# EAGLE board SARA-R5 (EAGLE 9.5.1)
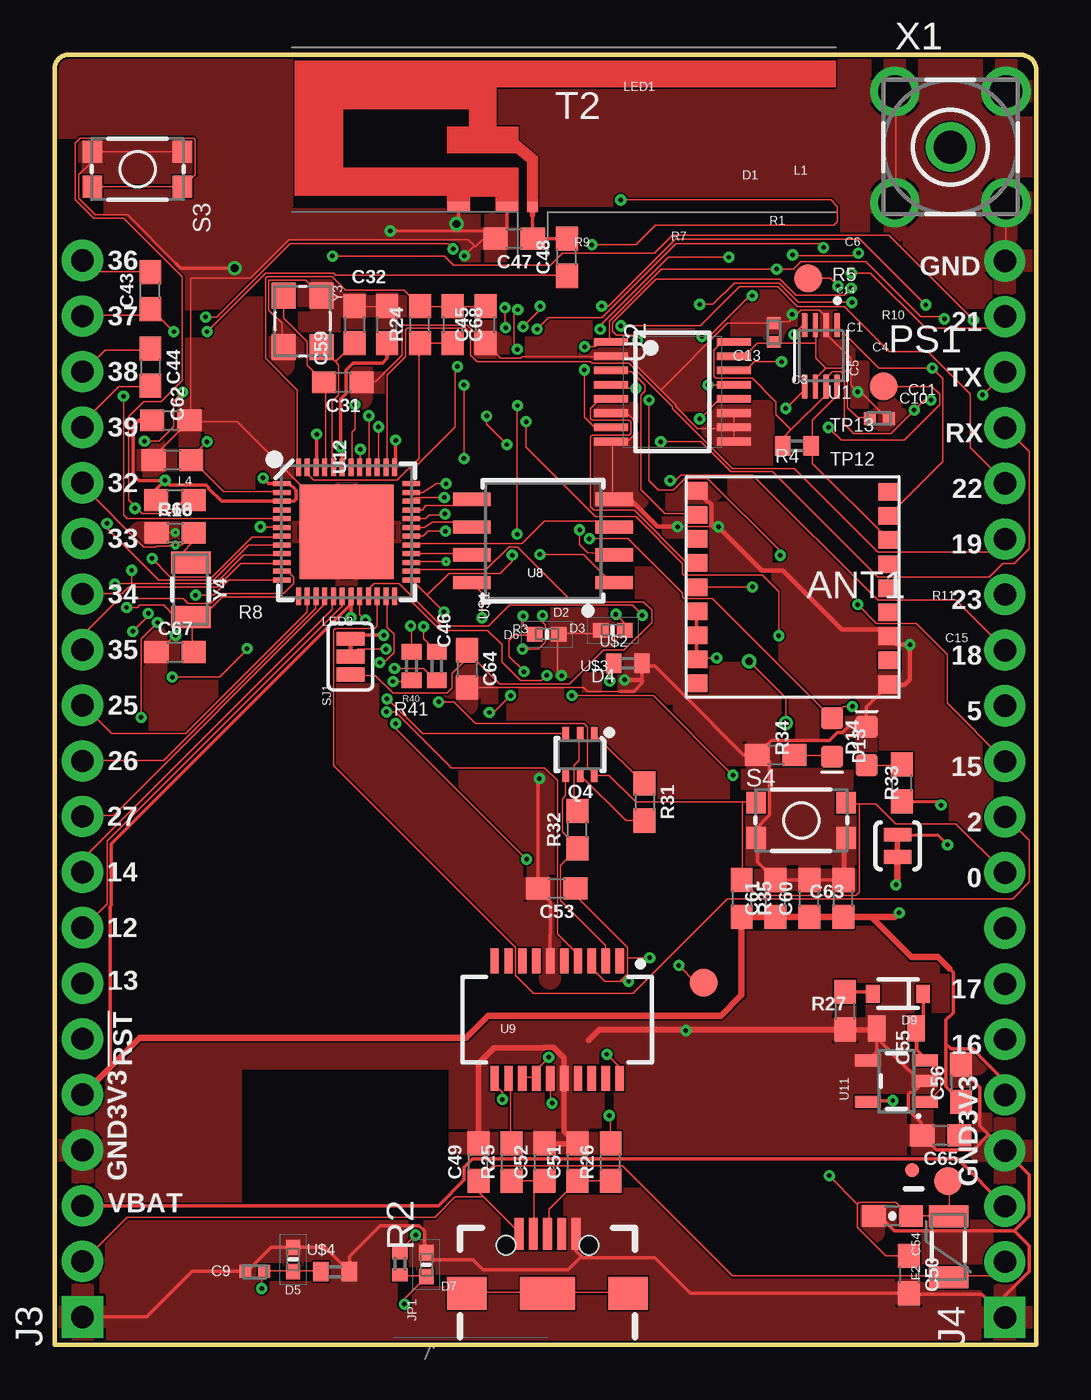
[diagram p3: board, top side]
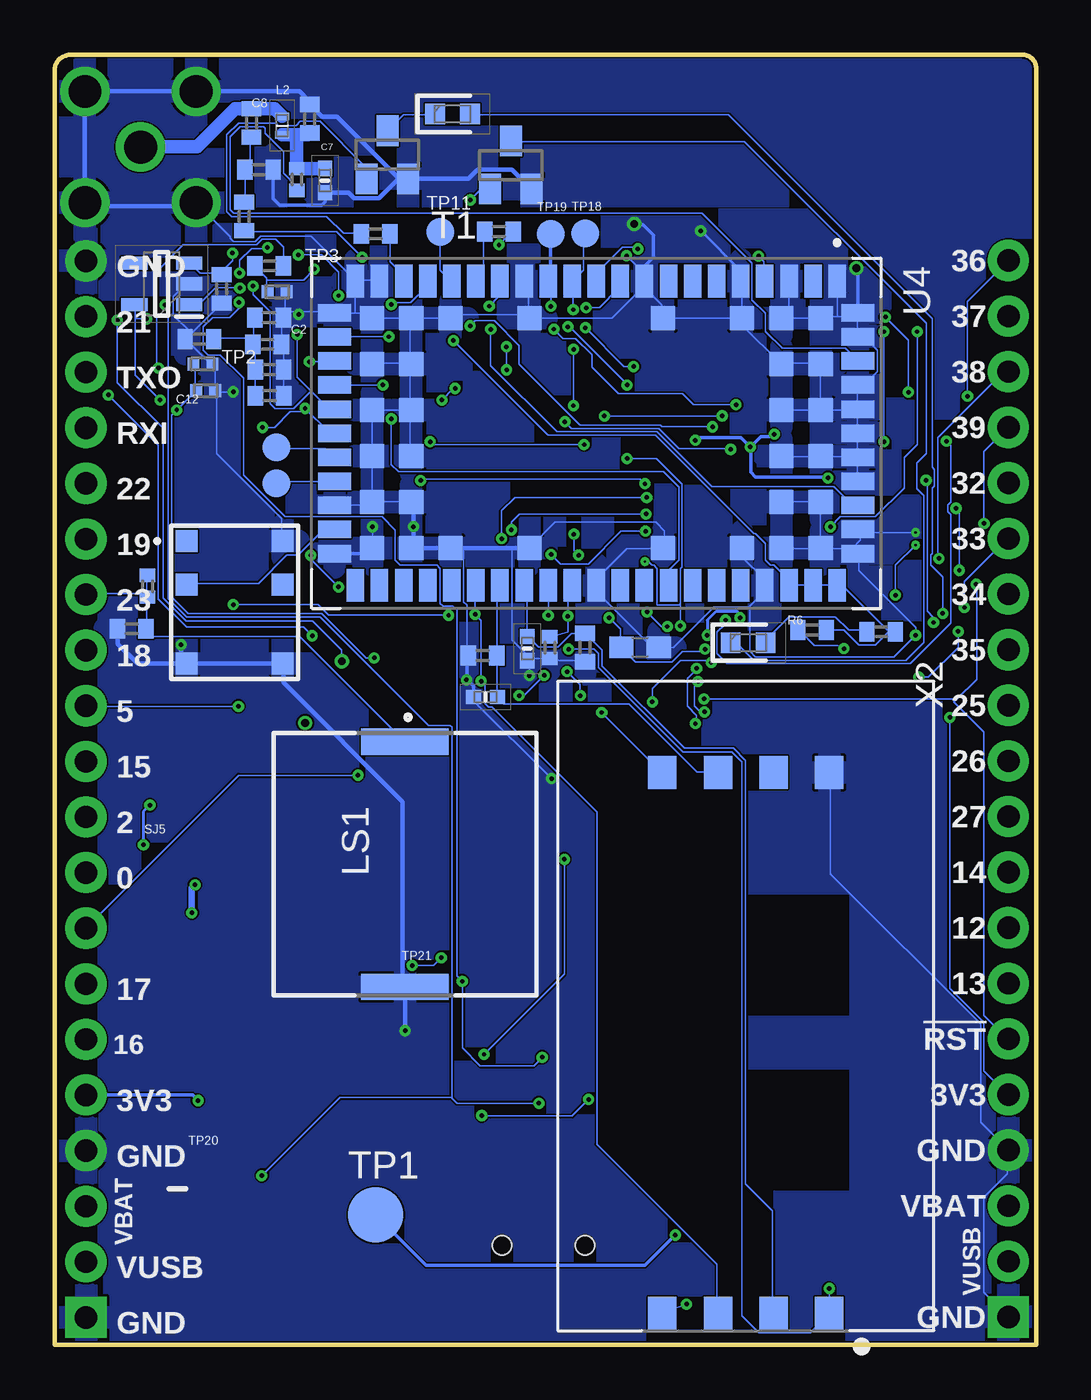
[diagram p4: board, bottom side, seen from below]

Size 44.84 x 58.93 mm. Coordinates in mm from the lower left corner, seen from the top.
Outline: 0,0 0,58.29 arc-90 0.64,58.93 44.02,58.92 arc-90 44.84,58.3 44.84,0.01 0,0
Copper layers (1*16): Top 0.035mm / dielectric 1.5mm / Bottom 0.035mm
Design rules "default *": minimum track width 3mil, minimum drill 2mil, track to track 3mil, track to pad 3mil, pad to pad 3mil, via to via 3mil, smd to smd 3mil, copper to edge 3mil, drill to drill 2mil, minimum pad ring 6mil, minimum via ring 6mil, stop-mask expansion 4mil, vias tented up to drill 25mil, thermal gap 5mil

## Footprints (pad centres in the part's own frame; a part is rotated, then mirrored left to right if it is on the bottom)
SR4G008 = smd 1 x 1: 1 -2.8,-2.2; 2 -0.8,-2.2; 3 2.8,-2.2; 4 2.8,2.2; 5 -0.8,2.2; 6 -2.8,2.2
C0402 = smd 0.7 x 0.9: 1 -0.65,0; 2 0.65,0
CAPC1005X55N = smd 0.54 x 0.6: 1 -0.432,0; 2 0.432,0
0603 = smd 1.1 x 1: 1 -0.85,0; 2 0.85,0
0603-CAP = smd 1.1 x 1: 1 -0.85,0; 2 0.85,0
0805 = smd 0.8 x 1.2: 1 -0.9,0; 2 0.9,0
DIONC1005X43N = smd 0.7 x 0.65: 1 -0.55,0; 2 0.55,0
SOD-323 = smd 0.63 x 0.83: A 1.15,0; C -1.15,0
LED-0603 = smd 1 x 1: A 0,-0.877; C 0,0.877
TRACE_ANTENNA_2.4GHZ_25.7MM_TUNED = smd 0.46 x 0.46: ANT 0,0.23 | smd 1 x 0.46: GND -1.18,0.23; GND2 -3.38,0.23
PTC-1206 = smd 1 x 1.8: 1 -1.4,0; 2 1.4,0
MICRO-FIDUCIAL = smd 0.635 x 0.635: 1 0,0
1X20_NOSILK = drill 1.016 pad 1.88 square: 1 0,0 | drill 1.016 pad 1.88: 2 2.54,0; 3 5.08,0; 4 7.62,0; 5 10.16,0; 6 12.7,0; 7 15.24,0; 8 17.78,0; 9 20.32,0; 10 22.86,0; 11 25.4,0; 12 27.94,0; 13 30.48,0; 14 33.02,0; 15 35.56,0; 16 38.1,0; 17 40.64,0; 18 43.18,0; 19 45.72,0; 20 48.26,0
USB-B-MICRO-SMD_V03 = smd 1.45 x 0.4: D+ 2.725,0; D- 2.725,0.65; GND 2.725,-1.3; ID 2.725,-0.65; VBUS 2.725,1.3 | smd 1.5 x 1.8: SHIELD1 0,3.685; SHIELD2 0,-3.685 | smd 1.5 x 2.5: SHIELD3 0,0 | hole 0.85: 2.2,1.9; 2.2,-1.9
L0402 = smd 0.7 x 0.9: 1 -0.65,0; 2 0.65,0
LQG15WH0N7B02D = smd 0.35 x 0.65: 1 -0.425,0; 2 0.425,0
LEDC1608X80N = smd 0.9 x 0.95: 1 -0.8,0; 2 0.8,0
PKLCS1212E2000-R1 = smd 1.2 x 4: 1 -5.6,0; 2 5.6,0
SOT95P280X145-5N = smd 1.2 x 0.6: 1 -1.25,0.95; 2 -1.25,0; 3 -1.25,-0.95; 4 1.25,-0.95; 5 1.25,0.95
SC70-6 = smd 0.3 x 0.66: 1 -0.65,-0.92; 2 0,-0.92; 3 0.65,-0.92; 4 0.65,0.92; 5 0,0.92; 6 -0.65,0.92
R0402 = smd 0.6 x 0.7: 1 -0.5,0; 2 0.5,0
R0402' = smd 0.7 x 0.9: 1 -0.65,0; 2 0.65,0
TACTILE_SWITCH_SMD_4.6X2.8MM = smd 0.9 x 1: 1 -2.05,-0.8; 2 2.05,-0.8; 3 2.05,0.8; 4 -2.05,0.8
PAD-JUMPER-3-2OF3_NC_BY_TRACE_YES_SILK_FULL_BOX = smd 0.635 x 1.27: 1 -0.813,0; 2 0,0; 3 0.813,0
PAD-JUMPER-2-NC_BY_TRACE_YES_SILK = smd 0.635 x 1.27: 1 -0.508,0; 2 0.508,0
SOT23 = smd 1 x 1.4: 1 -0.95,-1.1; 2 0.95,-1.1; 3 0,1.1
B2,54 = smd 2.54 x 2.54: TP 0,0
B1,27 = smd 1.27 x 1.27: TP 0,0
SOP50P310X90-8N = smd 1.12 x 0.27: 1 -1.405,0.75; 2 -1.405,0.25; 3 -1.405,-0.25; 4 -1.405,-0.75; 5 1.405,-0.75; 6 1.405,-0.25; 7 1.405,0.25; 8 1.405,0.75
TSSOP16 = smd 0.35 x 1.55: 1 -2.275,-2.8; 2 -1.625,-2.8; 3 -0.975,-2.8; 4 -0.325,-2.8; 5 0.325,-2.8; 6 0.975,-2.8; 7 1.625,-2.8; 8 2.275,-2.8; 9 2.275,2.8; 10 1.625,2.8; 11 0.975,2.8; 12 0.325,2.8; 13 -0.325,2.8; 14 -0.975,2.8; 15 -1.625,2.8; 16 -2.275,2.8
SARA-R5 = smd 1.5 x 0.8: 1 -6.95,11; 2 -6.95,9.9; 3 -6.95,8.8; 4 -6.95,7.7; 5 -6.95,6.6; 6 -6.95,5.5; 7 -6.95,4.4; 8 -6.95,3.3; 9 -6.95,2.2; 10 -6.95,1.1; 11 -6.95,0; 12 -6.95,-1.1; 13 -6.95,-2.2; 14 -6.95,-3.3; 15 -6.95,-4.4; 16 -6.95,-5.5; 17 -6.95,-6.6; 18 -6.95,-7.7; 19 -6.95,-8.8; 20 -6.95,-9.9; 21 -6.95,-11; 33 6.95,-11; 34 6.95,-9.9; 35 6.95,-8.8; 36 6.95,-7.7; 37 6.95,-6.6; 38 6.95,-5.5; 39 6.95,-4.4; 40 6.95,-3.3; 41 6.95,-2.2; 42 6.95,-1.1; 43 6.95,0; 44 6.95,1.1; 45 6.95,2.2; 46 6.95,3.3; 47 6.95,4.4; 48 6.95,5.5; 49 6.95,6.6; 50 6.95,7.7; 51 6.95,8.8; 52 6.95,9.9; 53 6.95,11 | smd 0.8 x 1.5: 22 -5.5,-11.95; 23 -4.4,-11.95; 24 -3.3,-11.95; 25 -2.2,-11.95; 26 -1.1,-11.95; 27 0,-11.95; 28 1.1,-11.95; 29 2.2,-11.95; 30 3.3,-11.95; 31 4.4,-11.95; 32 5.5,-11.95; 54 5.5,11.95; 55 4.4,11.95; 56 3.3,11.95; 57 2.2,11.95; 58 1.1,11.95; 59 0,11.95; 60 -1.1,11.95; 61 -2.2,11.95; 62 -3.3,11.95; 63 -4.4,11.95; 64 -5.5,11.95 | smd 1.1 x 1.1: 65 -5.25,10.25; 66 -3.15,10.25; 67 -1.05,10.25; 68 1.05,10.25; 69 3.15,10.25; 70 5.25,10.25; 71 -5.25,8.45; 72 -3.15,8.45; 73 -1.05,8.45; 74 1.05,8.45; 75 3.15,8.45; 76 5.25,8.45; 77 -5.25,6.65; 78 5.25,6.65; 79 -5.25,3.05; 80 5.25,3.05; 81 -5.25,-3.05; 82 5.25,-3.05; 83 -5.25,-6.65; 84 5.25,-6.65; 85 -5.25,-8.45; 86 -3.15,-8.45; 87 -1.05,-8.45; 88 1.05,-8.45; 89 3.15,-8.45; 90 5.25,-8.45; 91 -5.25,-10.25; 92 -3.15,-10.25; 93 -1.05,-10.25; 94 1.05,-10.25; 95 3.15,-10.25; 96 5.25,-10.25
SOIC-8 = smd 0.61 x 1.702: 1 -1.905,-3.251; 2 -0.635,-3.251; 3 0.635,-3.251; 4 1.905,-3.251; 5 1.905,3.251; 6 0.635,3.251; 7 -0.635,3.251; 8 -1.905,3.251
SSOP20_L = smd 0.381 x 1.143: 1 -2.857,-2.68; 2 -2.223,-2.68; 3 -1.587,-2.68; 4 -0.953,-2.68; 5 -0.318,-2.68; 6 0.318,-2.68; 7 0.953,-2.68; 8 1.587,-2.68; 9 2.223,-2.68; 10 2.857,-2.68; 11 2.857,2.68; 12 2.223,2.68; 13 1.587,2.68; 14 0.953,2.68; 15 0.318,2.68; 16 -0.318,2.68; 17 -0.953,2.68; 18 -1.587,2.68; 19 -2.223,2.68; 20 -2.857,2.68
SOT23-5 = smd 0.55 x 1.2: 1 -0.95,-1.3; 2 0,-1.3; 3 0.95,-1.3; 4 0.95,1.3; 5 -0.95,1.3
QFN48-0.4MM = smd 0.8 x 0.23: 1 -2.95,2.2; 2 -2.95,1.8; 3 -2.95,1.4; 4 -2.95,1; 5 -2.95,0.6; 6 -2.95,0.2; 7 -2.95,-0.2; 8 -2.95,-0.6; 9 -2.95,-1; 10 -2.95,-1.4; 11 -2.95,-1.8; 12 -2.95,-2.2; 25 2.95,-2.2; 26 2.95,-1.8; 27 2.95,-1.4; 28 2.95,-1; 29 2.95,-0.6; 30 2.95,-0.2; 31 2.95,0.2; 32 2.95,0.6; 33 2.95,1; 34 2.95,1.4; 35 2.95,1.8; 36 2.95,2.2 | smd 0.23 x 0.8: 13 -2.2,-2.95; 14 -1.8,-2.95; 15 -1.4,-2.95; 16 -1,-2.95; 17 -0.6,-2.95; 18 -0.2,-2.95; 19 0.2,-2.95; 20 0.6,-2.95; 21 1,-2.95; 22 1.4,-2.95; 23 1.8,-2.95; 24 2.2,-2.95; 37 2.2,2.95; 38 1.8,2.95; 39 1.4,2.95; 40 1,2.95; 41 0.6,2.95; 42 0.2,2.95; 43 -0.2,2.95; 44 -0.6,2.95; 45 -1,2.95; 46 -1.4,2.95; 47 -1.8,2.95; 48 -2.2,2.95 | smd 4.3 x 4.3: EP 0,0
INDC1005X45 = smd 0.7 x 0.9: 1 -0.65,0; 2 0.65,0
MAX-8 = smd 1 x 0.8: P$1 4.4,-4.35; P$2 4.4,-3.25; P$3 4.4,-2.15; P$4 4.4,-1.05; P$5 4.4,0.05; P$6 4.4,1.15; P$7 4.4,2.25; P$8 4.4,3.35; P$9 4.4,4.45; P$10 -4.4,4.5; P$11 -4.4,3.4; P$12 -4.4,2.3; P$13 -4.4,1.2; P$14 -4.4,0.1; P$15 -4.4,-1; P$16 -4.4,-2.1; P$17 -4.4,-3.2; P$18 -4.4,-4.3
LTI-SASF54GT = drill 1.5 pad 2.2: 1 0,0; 2 -2.54,2.54; 3 2.54,2.54; 4 2.54,-2.54; 5 -2.54,-2.54
C&K_CCM03-3013LFTR102 = smd 1.5 x 1.3: C1 12.35,3.81; C2 12.35,1.27; C3 12.35,-1.27; C5 -12.35,3.81; C6 -12.35,1.27; C7 -12.35,-1.27; SW1 12.35,-3.81; SW2 -12.35,-3.81
CRYSTAL-SMD-3.2X2.5 = smd 1.2 x 1.1: 1 -1.175,-0.875; 2 1.175,-0.875; 3 1.175,0.875; 4 -1.175,0.875
CRYSTAL-SMD-3.2X1.5MM = smd 1 x 1.8: P$1 -1.25,0; P$2 1.25,0

## Placement (x,y rotation side)
ANT1  SR4G008  [SR4G008]  36.62,33.92 270 bottom
C1  10uF  [C0402]  35.05,46.92 0 bottom
C2  100nF  [C0402]  35.13,45.7 0 bottom
C3  10nF  [C0402]  35.02,43.35 0 bottom
C4  68pF  [C0402]  38.23,45.94 180 bottom
C5  15pF  [C0402]  35.03,44.54 0 bottom
C6  15pF  [C0402]  36.19,51.54 90 bottom
C7  27pF GRM1555C1H270JA16  [C0402]  33.19,56 270 bottom
C8  33pF GRM1555C1H330JA16  [C0402]  35.85,55.81 270 bottom
C9  GCM155R71C104KA55J  [CAPC1005X55N]  9.14,3.35 180 top
C10  GCM155R71C104KA55J  [CAPC1005X55N]  37.67,42.31 0 top
C11  GCM155R71C104KA55J  [CAPC1005X55N]  37.94,43.59 180 bottom
C12  GCM155R71C104KA55J  [CAPC1005X55N]  38.07,44.79 0 bottom
C13  GCM155R71C104KA55J  [CAPC1005X55N]  32.84,46.24 90 top
C14  GCM155R71C104KA55J  [CAPC1005X55N]  34.68,48.11 180 bottom
C15  1uF  [C0402]  41.32,32.71 180 bottom
C31  10pF  [0603]  13.17,43.96 180 top
C32  10pF  [0603]  13.7,46.6 270 top
C43  270pF  [0603]  4.37,48.15 90 top
C44  270pF  [0603]  4.37,44.66 270 top
C45  10nF  [0603]  19.67,46.6 90 top
C46  0.1uF  [0603]  18.1,31.86 0 bottom
C47  2.4pF  [0603]  20.99,50.52 180 top
C48  5.6pF  [0603]  23.39,49.67 90 top
C49  0.1uF  [0603]  19.36,8.34 90 top
C50  0.1uF  [0603]  39.02,3.2 270 top
C51  47pF  [0603]  23.89,8.34 90 top
C52  47pF  [0603]  22.38,8.34 90 top
C53  0.1uF  [0603]  22.93,20.84 180 top
C54  4.7uF  [0603-CAP]  38.27,5.88 180 top
C55  1.0uF  [0805]  38.45,14.45 180 top
C56  2.2uF  [0603]  41.41,11.95 90 top
C59  100pF  [0603]  15.19,46.6 90 top
C60  0.1uF  [0603]  34.48,20.38 90 top
C61  0.1uF  [0603]  32.93,20.38 90 top
C62  10uF  [0603]  5.31,42.22 0 top
C63  0.1uF  [0603]  36.03,20.38 90 top
C64  1.0uF  [0603]  18.83,30.87 270 top
C65  0.1uF  [0603]  40.48,9.56 180 top
C66  15pF  [0603]  5.5,37.09 0 top
C67  15pF  [0603]  5.5,31.64 0 top
C68  3.0nF  [0603]  18.18,46.6 270 top
D1  PESD0402-140  [DIONC1005X43N]  32.49,53.18 90 bottom
D2  PESD0402-140  [DIONC1005X43N]  23.25,31.8 90 bottom
D3  PESD0402-140  [DIONC1005X43N]  25.49,32.64 0 top
D4  PESD0402-140  [DIONC1005X43N]  25.16,29.59 0 bottom
D5  PESD0402-140  [DIONC1005X43N]  10.89,3.9 270 top
D6  PESD0402-140  [DIONC1005X43N]  22.48,32.46 180 top
D7  PESD0402-140  [DIONC1005X43N]  16.98,3.66 270 top
D9  BAT20J  [SOD-323]  38.52,16.03 180 top
D13  RED  [LED-0603]  37.09,27.35 0 top
D14  BLUE  [LED-0603]  35.52,27.74 180 top
E2  ANTENNA  [TRACE_ANTENNA_2.4GHZ_25.7MM_TUNED]  21.84,51.74 0 top
F2  500mA  [PTC-1206]  40.83,4.47 90 top
FD3  FIDUCIALUFIDUCIAL  [MICRO-FIDUCIAL]  39.16,7.99 0 top
J3  [1X20_NOSILK]  1.27,1.27 90 top
J4  [1X20_NOSILK]  43.41,1.25 90 top
JP1  [USB-B-MICRO-SMD_V03]  22.51,2.35 90 top
L1  39nH  [L0402]  35.51,53.68 0 bottom
L2  LQG15HS68NJ02B  [LQG15WH0N7B02D]  34.45,55.69 90 bottom
L4  2.7nH  [0603]  5.38,40.41 180 top
LED1  LTST-C190KRKT  [LEDC1608X80N]  26.67,56.22 0 bottom
LED2  LTST-C190KRKT  [LEDC1608X80N]  13.16,32.07 0 bottom
LS1  PKLCS1212E2000-R1  [PKLCS1212E2000-R1]  28.84,21.95 270 bottom
PS1  TPS7A0530PDBVR  [SOT95P280X145-5N]  39.95,48.46 180 bottom
Q4  MBT3904DW1T1  [SC70-6]  24,26.96 180 top
R1  10K  [R0402]  33.78,53.23 90 bottom
R2  1K  [R0402]  15.77,3.7 270 top
R3  470K  [R0402]  22.22,31.84 270 bottom
R4  4.7K  [R0402']  33.9,41.06 180 top
R5  4.7K  [R0402']  35.04,49.28 180 bottom
R6  820  [R0402']  10.24,32.65 0 bottom
R7  10K  [R0402']  30.18,50.74 0 bottom
R8  820  [R0402']  7.09,32.57 0 bottom
R9  10K  [R0402']  24.54,50.85 180 bottom
R10  47K  [R0402']  37.21,48.23 90 bottom
R11  0R  [R0402]  40.6,34.65 90 bottom
R18  10k  [0603]  5.49,38.59 180 top
R24  20k  [0603]  16.69,46.6 90 top
R25  27  [0603]  20.87,8.34 90 top
R26  27  [0603]  25.4,8.34 90 top
R27  10k  [0603]  36.11,15.26 90 top
R31  10k  [0603]  26.94,24.79 270 top
R32  10k  [0603]  23.88,23.53 90 top
R33  1K  [0603]  38.7,25.66 90 top
R34  330  [0603]  32.94,26.95 0 top
R35  10k  [0603]  31.38,20.38 270 top
R40  0R  [R0402']  17.46,31 90 top
R41  0R  [R0402']  16.3,31 270 top
S3  RESET  [TACTILE_SWITCH_SMD_4.6X2.8MM]  3.78,53.7 180 top
S4  BTN-0  [TACTILE_SWITCH_SMD_4.6X2.8MM]  34.1,23.96 0 top
SJ1  [PAD-JUMPER-3-2OF3_NC_BY_TRACE_YES_SILK_FULL_BOX]  13.51,31.43 90 top
SJ5  JUMPER-PAD-2-NC_BY_TRACE  [PAD-JUMPER-2-NC_BY_TRACE_YES_SILK]  38.51,22.79 270 top
T1  BC847  [SOT23]  29.64,54.36 0 bottom
T2  BC847  [SOT23]  24,53.89 0 bottom
TP1  TPB2,54  [B2,54]  30.18,5.93 0 bottom
TP2  TPB1,27  [B1,27]  37.86,43.79 0 top
TP3  TPB1,27  [B1,27]  34.42,48.72 0 top
TP11  TPB1,27  [B1,27]  27.23,50.82 0 bottom
TP12  TPB1,27  [B1,27]  34.71,39.35 0 bottom
TP13  TPB1,27  [B1,27]  34.71,40.99 0 bottom
TP18  TPB1,27  [B1,27]  20.61,50.77 0 bottom
TP19  TPB1,27  [B1,27]  22.19,50.75 0 bottom
TP20  TPB1,27  [B1,27]  40.82,7.48 0 top
TP21  TPB1,27  [B1,27]  29.64,16.54 0 top
U1  TCA9406DCUR  [SOP50P310X90-8N]  35,45.17 270 top
U2  SN74AVC4T774  [TSSOP16]  28.22,43.53 270 top
U4  SARA-R5  [SARA-R5]  20.1,41.64 270 bottom
U8  W25Q32FVSS  [SOIC-8]  22.31,36.72 90 top
U9  FT231XS  [SSOP20_L]  22.95,14.85 180 top
U11  AP2112K-3.3V  [SOT23-5]  38.45,12.04 90 top
U12  ESP3212  [QFN48-0.4MM]  13.34,37.13 0 top
U$1  GRM1555C1E680JA01  [INDC1005X45]  20.62,31.85 270 bottom
U$2  GRM1555C1E680JA01  [INDC1005X45]  26.18,31.13 0 top
U$3  GRM1555C1E680JA01  [INDC1005X45]  25.3,31.48 180 bottom
U$4  GRM1555C1E680JA01  [INDC1005X45]  12.81,3.34 0 top
U$5  MAX-8  [MAX-8]  33.72,34.66 180 top
X1  LTI-SASF54GT  [LTI-SASF54GT]  40.92,54.71 0 top
X2  CCM03-3013LFT_R102  [C&K_CCM03-3013LFTR102]  13.27,13.8 270 bottom
Y3  26MHz  [CRYSTAL-SMD-3.2X2.5]  11.33,46.75 270 top
Y4  32.768kHz  [CRYSTAL-SMD-3.2X1.5MM]  6.22,34.49 270 top

## Tracks (layer width: path | path; a pad name or v marks a point on that pad's centre or on a via)
0  (via drill 0.2)
  Top 0.076: 36.75,24.71 37.52,24.71 38.43,23.8 41.17,23.8 43.38,21.59 J4.9 | 36.75,24.71 36.22,24.71 S4.3 | 31.42,24.79 32.03,24.79 S4.4 | 31.42,24.79 26.54,24.79 25.32,26.01 24.71,26.01 Q4.6 24.64,26.09 24.33,26.39 24.33,28.22 24.18,28.37 19.23,28.37 18.23,29.36 v17.54,29.36 | U12.23 15.19,34.16 15.19,32.77 15.5,32.46 15.5,31.63 15.05,31.17 v14.85,31.17 v14.85,31.16 | 31.42,24.79 31.42,21.28 R35.1 31.42,21.21 32.11,20.52 36.6,20.52 36.75,20.68 36.75,24.71
  Bottom 0.076: v14.85,31.16 14.95,31.27 16.26,31.27 17.54,29.98 v17.54,29.36
1V8
  Top 0.076: U2.15 31.04,45.21 31.57,45.21 32.11,45.74 32.79,45.74 C13.1 32.87,45.74 34.77,45.74 | 35.23,44.6 35.99,44.6 36.22,44.37 36.22,42.82 36.68,42.36 37.21,42.36 37.21,42.32 C10.1 | 35.23,44.6 34.77,44.14 34.77,43.84 U1.6 | 34.77,45.74 34.77,45.06 35.23,44.6 | 34.77,45.74 34.77,46.51 U1.3
2
  Top 0.076: U12.22 14.73,34.16 14.73,32.84 14.62,32.72 12.84,32.72 12.75,32.64 12.75,26.47 21.06,18.16 21.06,16.87 21.87,16.05 26.41,16.05 30.73,20.37 43.76,20.37 44.53,21.13 44.53,23.04 43.46,24.1 J4.10
3.3V  (via drill 0.2, 0.2 pad 0.1)
  Top 0.076: R35.2 31.42,19.53 32.87,19.53 C61.1 32.94,19.53 34.47,19.53 C60.1 34.54,19.53 35.99,19.53 C63.1 36.07,19.53 36.09,19.53 | C65.1 41.33,9.63 41.33,11 41.4,11.07 C56.1 | 42.45,12.99 41.94,13.51 | 11.97,40.26 11.97,40.1 U12.46 | C59.1 | U12.4 10.39,38.2 10.39,38.51 U12.3 | 10.39,39.27 U12.1 | 1.33,11.46 1.32,11.45 J3.5 | v4.69,32.99 3.94,32.24 v3.94,28.66 | 9.54,39.56 v9.51,39.6
  Top 0.152: v13.53,33.21 U12.19 13.53,33.84 2.58,22.88 2.58,20.06 2.54,20.02 2.54,12.67 | SJ1.3 13.67,32.41 v15.03,32.41 | C56.1 40.72,11.79 40.72,13.75 | 40.72,13.75 40.72,14.85 41.04,15.17 41.04,17.01 40.86,17.19 | J4.5 43.41,12.04 42.45,12.99 42.06,13.39 42.06,13.42 41.96,13.51 41.94,13.51 40.95,13.51 40.72,13.75 | U11.5 37.2,11.15 v38.29,11.15 | v5.03,39.48 5.25,39.27 6.93,39.27 7.04,39.15 7.04,39.11 7.62,38.53 U12.3 10.93,38.53 11.03,38.64 11.03,39.02 10.91,39.14 10.78,39.27 10.72,39.33 U12.1 9.77,39.33 9.54,39.56 | v5.03,39.48 4.64,39.09 R18.2 | v5.03,39.48 3.86,39.48 3.57,39.77 3.57,41.96 3.84,42.22 | v15.57,41.32 15.57,40.12 U12.37 | U12.43 13.14,40.94 v13.07,41.01 13.07,43.2 13.31,43.45 13.31,44.52 13.64,44.85 14.97,44.85 15.19,45.07 15.19,45.5 | v11.97,41.59 11.97,40.26
  Top 0.2: 3.84,42.22 C62.1 | 15.19,45.5 C59.1
  Top 0.305: 36.09,19.53 R35.2 31.38,15.98 30.43,15.03 19.8,15.03 18.79,14.02 3.89,14.02 2.54,12.67 1.33,11.46 | C63.1 37.3,19.53 | 37.3,19.53 38.39,19.53 v38.58,19.73 | SJ5.2 38.51,21.09 v38.43,21.01 | 37.3,19.53 39.12,17.71 40.34,17.71 40.86,17.19
  Bottom 0.076: v11.97,41.59 | 13.05,40.99 v13.07,41.01 | v5.03,39.48 4.98,39.44 4.98,33.52 4.69,33.23 v4.69,32.99 | v3.94,28.66 3.94,16.29 2.39,14.73 2.39,12.52 1.32,11.45 J3.5
  Bottom 0.127: v15.03,32.41 15.03,33.1 14.62,33.5 13.66,33.5 13.53,33.37 v13.53,33.21
  Bottom 0.152: v38.29,11.15 38.55,11.41 J4.5 | v9.51,39.6 9.56,39.64 12.83,39.64 13.05,39.87 13.05,40.99 | v11.97,41.59 12.07,41.49 12.58,41.49 v13.07,41.01 13.49,41.44 15.45,41.44 v15.57,41.32
  Bottom 0.305: v38.43,21.01 38.58,20.86 v38.58,19.73
3V0  (via drill 0.2)
  Top 0.076: v24.19,44.53 24.19,42.38 24.64,41.94 25.4,41.94 U2.7 | v24.2,45.59 24.71,45.59 24.87,45.74 25.4,45.74 U2.1 25.34,45.89 25.34,46.76 27.71,49.14 v32.98,49.14 33.75,49.14 34.09,49.48 37.05,49.48 39.56,46.96 40.55,46.96 v40.65,46.86 | 33.64,41.8 35.23,43.38 35.23,43.76 U1.7 35.31,43.84 35.31,44.22 35.54,44.45 35.92,44.45 36.07,44.3 36.07,42.06 36.51,41.62 38.19,41.62 v39.27,42.7 39.73,43.16 v40.03,43.16 | 33.64,41.8 33.33,41.48 33.33,41.1 R4.2 | 33.64,41.8 32.96,42.48 32.96,43.07 31.88,44.14 30.2,44.14 30.12,44.22 30.12,45.44 30.43,45.74 30.96,45.74 U2.16 | v30.24,31.37 29.4,31.37 U$5.P$8
  Top 0.152: U$5.P$8 U$5.P$7 U$5.P$6
  Bottom 0.076: 35.15,48.64 35.15,48.72 35.69,49.25 R5.2 | 35.15,48.64 35.15,48.18 C14.2 | 35.15,48.64 33.48,48.64 v32.98,49.14 | v24.2,45.59 v24.19,45.58 v24.19,44.53 | 41.17,46.86 41.17,44.3 v40.03,43.16 | 41.17,46.86 41.17,47.5 PS1.5 | C12.1 38.43,44.75 38.43,43.61 C11.2 38.43,43.54 v39.27,42.7 39.5,42.47 39.5,34.16 38.73,33.4 32.64,33.4 30.61,31.37 v30.24,31.37 | 41.17,46.86 v40.65,46.86
3V8  (via drill 0.2)
  Top 0.076: v36.38,48.27 36.07,47.95 33.86,47.95 33.13,48.68 27.48,48.68 25.49,46.7 25.49,46.29 25.65,46.13 26.37,46.13 v26.63,45.87
  Bottom 0.076: 6.66,32.64 6.81,32.64 8.79,34.62 9.09,34.62 U4.53 9.17,34.7 10.16,34.7 U4.52 10.24,34.7 11.23,34.7 U4.51 11.3,34.92 11.99,35.61 12.14,35.61 12.37,35.84 12.37,36.6 12.83,37.06 12.9,37.06 17.4,41.55 22.31,41.55 v26.63,45.87 | 6.66,32.64 6.5,32.64 R8.2 6.66,32.64 | 6.66,32.64 7.34,31.95 8.1,31.95 8.79,32.64 9.55,32.64 R6.2 | v36.38,48.27 36.39,48.28 37.5,48.28 38.2,47.57 38.66,47.57 PS1.1
4  (via drill 0.2)
  Top 0.076: v22.48,30.58 22.24,30.34 21.28,30.34 20.42,31.19 20.42,31.99 19.78,32.63 17.63,32.63 16.1,34.16 15.57,34.16 U12.24 | v23.63,29.65 27.35,29.65 v30.99,26.02
  Bottom 0.076: v23.63,29.65 23.41,29.65 v22.48,30.58 | v30.99,26.02 36.44,26.02 43.38,19.07 J4.8
5  (via drill 0.2)
  Top 0.076: v17.8,38.71 16.46,38.71 U12.34 | v24.42,36.82 26.19,36.82 28.68,34.34 28.68,34.16 28.75,34.09 30.05,34.09 35.46,28.68 D14.A 35.54,28.68 36.02,29.16 v36.45,29.16
  Bottom 0.076: v24.42,36.82 24.42,38.1 23.82,38.71 v17.8,38.71 | v36.45,29.16 43.4,29.16 J4.12
12
  Top 0.076: U12.18 13.13,34.16 13.13,33.75 2.39,23 2.39,20.14 1.32,19.07 J3.8
14
  Top 0.076: U12.17 12.67,34.16 12.67,33.59 1.32,22.23 1.32,21.59 J3.9
15  (via drill 0.2)
  Top 0.076: v26.85,33.33 26.39,33.78 20.78,33.78 19.83,32.83 17.67,32.83 15.72,34.77 14.58,34.77 14.35,34.54 14.35,34.24 U12.21 | v36.68,33.81 37.55,32.94 39.36,32.94 40.77,31.54 40.77,29.31 43.38,26.7 J4.11
  Bottom 0.076: v26.85,33.33 32.33,33.33 32.82,33.81 v36.68,33.81
18  (via drill 0.2)
  Top 0.076: v17.88,39.33 17.45,39.33 16.8,38.94 U12.35 | v28.12,39.48 28.14,39.5 28.38,39.5 28.6,39.73 31.88,39.73 37.59,34.01 41.17,34.01 43.38,31.8 J4.13
  Bottom 0.076: v17.88,39.33 18.1,39.55 28.05,39.55 v28.12,39.48
19
  Top 0.076: U12.38 15.19,40.11 15.19,44.3 16.03,45.14 16.03,46.35 16.1,46.43 18.77,46.43 19,46.2 19,45.21 19.3,44.91 24.49,44.91 24.56,44.83 26.24,44.83 28.22,42.85 28.22,42.77 30.96,40.03 33.78,40.03 37.59,36.22 42.85,36.22 43.38,36.75 J4.15
21  (via drill 0.2)
  Top 0.076: v13.71,42.94 13.71,41.82 13.59,41.7 13.59,40.11 U12.42 | v22.03,46.39 22.56,46.91 25.01,46.91 28.39,50.29 34.95,50.29 v35.12,50.12 | v36.4,48.96 37.27,48.96 39.8,46.43 42.85,46.43 43.38,46.96 J4.19
  Bottom 0.076: v13.71,42.94 15.66,42.94 16.17,43.45 19.09,43.45 20.29,44.65 20.29,45.22 21.04,45.97 21.61,45.97 v22.03,46.39 | v35.12,50.12 35.16,50.08 35.86,50.08 36.4,49.53 v36.4,48.96
22  (via drill 0.2)
  Top 0.076: v14.79,41.93 14.79,40.1 U12.39 | v25.86,46.54 29.49,46.54 31.28,48.33 33.03,48.33 33.93,47.42 36.07,47.42 38.13,45.36 39.89,45.36 41.83,43.42 41.83,40.98 43.38,39.42 J4.16
  Bottom 0.076: v14.79,41.93 17.09,41.93 17.17,42.01 20.84,42.01 23.62,44.79 23.62,45.63 24.76,46.77 25.63,46.77 v25.86,46.54
23
  Bottom 0.076: 40.64,34.31 40.64,35.08 R11.2 | 40.64,34.31 40.64,34.16 R11.1 | R11.1 40.64,34.09 40.64,32.71 C15.1 40.52,32.35 33.64,32.35 28.91,27.61 LS1.1 | 40.64,34.31 43.38,34.31 J4.14 | 40.64,34.31 R11.1
25
  Top 0.076: U12.14 11.53,34.16 11.53,33.48 5.99,27.93 2.6,27.93 1.32,29.21 J3.12
26
  Top 0.076: U12.15 11.91,34.16 11.91,33.63 4.98,26.7 1.32,26.7 J3.11
27
  Top 0.076: U12.16 12.29,34.16 12.29,33.78 2.69,24.18 1.32,24.18 J3.10
32K_XN  (via drill 0.2)
  Top 0.076: U12.13 11.07,34.16 7.64,34.16 6.73,33.25 6.27,33.25 Y4.P$2 | C67.2 6.27,31.67 6.27,33.17 Y4.P$2 | v3.28,33.68 3.78,33.68 3.89,33.78 4.98,33.78 5.51,33.25 6.2,33.25 Y4.P$2
  Bottom 0.076: v3.28,33.68 3.28,34.86 1.32,36.83 J3.15
32K_XP  (via drill 0.1, 0.2)
  Top 0.076: v6.43,34.24 7.27,34.24 7.95,34.92 10.31,34.92 U12.12 | Y4.P$1 6.27,35.76 5.84,36.2 6.28,36.64 C66.2 5.79,36.52 v5.51,36.52 5.3,36.52 5.25,36.48 4.64,36.48 4.61,36.45 4.06,36.45 1.32,39.19 1.32,39.34 J3.16
  Bottom 0.076: v6.43,34.24 6.43,35.61 v5.51,36.52
34
  Top 0.076: U12.10 10.31,35.69 8.48,35.69 7.42,34.62 3.38,34.62 3.07,34.31 1.32,34.31 J3.14
35
  Top 0.076: U12.11 10.39,35.31 10.69,35.31 10.92,35.08 10.92,34.77 10.47,34.31 7.57,34.31 7.12,33.87 6.1,33.87 5.88,34.09 2.94,34.09 1.27,32.42 J3.13
36  (via drill 0.2)
  Top 0.076: v3.14,43.33 3.14,37.91 3.3,37.74 10.31,37.74 U12.5 | J3.20 1.78,49.02 4.37,49.02 C43.2
  Bottom 0.076: v3.14,43.33 3.14,47.66 J3.20
37  (via drill 0.2)
  Top 0.076: v9.4,37.36 10.31,37.36 U12.6 | v5.44,46.28 4.45,47.27 C43.1 4.37,47.27 4.14,47.04 1.32,47.04 J3.19
  Bottom 0.076: v9.4,37.36 8.94,37.82 7.34,37.82 6.02,39.14 6.02,40.53 5.44,41.11 v5.44,46.28
38  (via drill 0.2)
  Top 0.076: v4.45,35.92 5.28,35.08 7.19,35.08 9.02,36.91 10.31,36.91 U12.7 | C44.1 4.37,45.44 2.31,45.44 1.32,44.45 J3.18
  Bottom 0.076: v4.45,35.92 4.5,35.97 4.5,41.44 1.48,44.45 J3.18
39  (via drill 0.2)
  Top 0.076: v2.39,37.52 2.39,37.29 4.75,34.92 7.26,34.92 8.86,36.52 10.31,36.52 U12.8 | J3.17 1.27,42.11 2.92,43.76 4.37,43.76 C44.2
  Bottom 0.076: v2.39,37.52 2.39,40.79 J3.17
ANT  (via drill 0.2)
  Top 0.076: v30.79,49.68 28.04,49.68 24.92,46.57 v24.92,46.39
  Bottom 0.076: v30.79,49.68 31.96,50.85 36.14,50.85 C6.1 | v24.92,46.39 24.92,44.73 21.89,41.71 17.32,41.71 14.81,39.19 9.25,39.19 8.41,38.35 8.18,38.35 U4.56
ANT_DET
  Bottom 0.076: R1.1 33.78,52.76 33.78,52.91 34.39,53.52 34.39,54.51 35.23,55.35 35.23,55.57 35.31,55.65 36.37,55.65 36.83,55.19 36.83,51.84 36.68,51.69 15.27,51.69 12.98,49.4 12.98,47.73 12.37,47.12 12.37,46.28 11.61,45.52 8.71,45.52 8.18,44.98 U4.62
ANT_GNSS
  Bottom 0.076: ANT1.2 38.81,34.77 35.54,34.77 34.24,36.07 33.73,36.07 32.58,37.21 32.11,37.21 U4.31
CAP_10N1
  Top 0.076: C45.2 19.61,47.42 18.24,47.42 C68.1 18.16,47.42 16.71,47.42 R24.2 15.95,48.18 13.28,48.18 12.67,48.79 9.7,48.79 9.63,48.72 9.63,45.06 11.07,43.61 11.07,40.11 U12.48
CHIP_PU  (via drill 0.2)
  Top 0.076: S3.3 1.78,52.91 5.82,52.91 S3.4 5.89,52.91 6.43,53.44 6.43,55.04 6.35,55.12 1.17,55.12 0.94,54.89 0.94,52.3 1.78,51.46 3.15,51.46 5.82,48.79 5.82,44.04 4.86,43.08 4.06,43.08 3.38,42.4 3.38,38.58 3.67,38.3 | 3.67,38.3 3.99,37.97 5.28,37.97 5.89,38.58 6.27,38.58 R18.1 | v15.17,29.5 15.2,29.5 16.79,27.91 23.34,27.91 Q4.3 | 3.52,34.77 2.78,34.77 v2.75,34.74 | 3.52,34.77 7.34,34.77 8.64,36.07 10.31,36.07 U12.9 | v3.67,38.21 3.67,38.3 | 3.52,34.77 v3.52,35.38
  Bottom 0.076: 3.62,29.5 v15.17,29.5 | J3.6 1.32,13.97 2.39,15.04 2.39,27.99 3.76,29.36 3.62,29.5 | v2.75,34.74 2.73,34.72 2.73,30.39 3.62,29.5 | v3.67,38.21 3.52,38.06 v3.52,35.38
CTS  (via drill 0.2)
  Top 0.076: U12.20 13.93,33.37 v14.19,33.11 | v4.1,41.27 4.77,41.27 5.44,41.94 5.44,43.11 v5.84,43.52 | v6.89,46.95 7.4,46.95 10.75,50.3 17.96,50.3 v18.2,50.06
  Bottom 0.076: v14.19,33.11 14.23,33.07 14.23,32.91 14.58,32.56 14.58,31.57 14.12,31.11 5.75,31.11 3.9,32.97 3.9,37.92 4.03,38.06 4.03,38.36 3.9,38.49 3.9,41.07 v4.1,41.27 | v5.84,43.52 5.84,45.89 v6.89,46.95 | v18.2,50.06 18.29,50.15 18.9,50.15 20.07,48.98 20.07,48.64 U4.11
D+
  Top 0.076: R26.1 25.32,7.49 23.95,7.49 C51.1 23.88,7.49 22.58,6.2 22.58,5.13 JP1.D+
D-
  Top 0.076: 21.89,7.49 22.35,7.49 C52.1 21.89,7.49 | 21.89,7.49 20.9,7.49 R25.1 | 21.89,7.49 21.89,5.13 JP1.D-
DTS
  Top 0.076: Q4.1 24.71,27.84 26.92,25.63 R31.1
EXTINT  (via drill 0.2)
  Top 0.076: v31.88,34.62 29.36,34.62 U$5.P$5 | v33.15,36.06 33.15,36.25 29.82,39.57 28.8,39.57 28.27,39.05 27.58,39.05 27.15,39.47 v27.15,43.16 | v26.55,43.69 25.63,43.69 25.48,43.84 U2.4
  Bottom 0.076: v31.88,34.62 33.15,35.89 v33.15,36.06 | v27.15,43.16 26.62,43.69 v26.55,43.69
FLASH_SCK
  Top 0.076: U12.31 16.86,37.33 17.26,37.57 18.98,37.57 U8.6
FLASH_SCS  (via drill 0.2)
  Top 0.076: v17.85,37.17 17.07,37.17 16.84,36.94 U12.30 | v22.17,36.1 24.15,36.1 25.48,34.77 U8.1
  Bottom 0.076: v17.85,37.17 18.97,37.17 20.46,35.67 21.74,35.67 v22.17,36.1
FLASH_SDI
  Top 0.076: U12.33 16.8,38.13 16.94,38.33 18.75,38.33 19.03,38.61 U8.5
FLASH_SDO  (via drill 0.2)
  Top 0.076: v17.83,37.95 17.78,37.9 17.11,37.9 16.95,37.73 U12.32 | v23.98,37.23 23.98,36.56 24.34,36.19 U8.2
  Bottom 0.076: v23.98,37.23 23.98,37.58 23.61,37.95 v17.83,37.95
FLASH_SHD
  Top 0.076: U8.7 19,36.15 U12.28
FLASH_SWP
  Top 0.076: U8.3 25.3,37.62 22.37,37.62 21.35,36.6 16.33,36.6 U12.29
FLASH_VDD
  Top 0.076: 19,31.5 18.85,31.65 C64.1 19,31.5 | 19,31.5 20.31,30.18 23.52,30.18 25.06,31.72 26.01,31.72 27.27,32.99 27.27,33.56 26.9,33.93 23.65,33.93 21.14,36.44 20.75,36.44 19.71,35.4 16.35,35.4 U12.26 | 19,31.5 18.16,30.66 18.16,30 17.93,29.77 15.45,29.77 14.64,30.58 13.51,30.58 SJ1.1
GND  (via drill 0.1, 0.2, 0.2 pad 0.1, 0.2 pad 0.3, 0.35)
  Top 0.076: 42.93,1.78 43.38,1.32 J4.1 42.93,1.78 | 42.93,1.78 42.39,2.31 39.04,2.31 C50.2 | 37.74,5.82 37.44,5.82 C54.2 | 43.38,8.94 J4.4 | 44.14,3 42.93,1.78 | C52.2 22.43,9.17 22.47,9.17 23.85,9.17 23.88,9.17 C51.2 | R27.1 36.14,14.43 37.52,14.43 C55.2 37.59,14.43 37.59,14.29 | 39.57,11.99 38.96,11.38 38.96,10.77 39.05,10.69 39.13,10.61 39.57,10.16 39.57,9.63 39.6,9.59 C65.2 | 39.57,11.99 39.73,11.99 U11.2 39.57,11.99 | 39.57,11.99 38.57,13 | 42.01,8.94 42.65,9.58 42.66,9.59 42.67,9.6 | 8.81,3.38 8.71,3.38 C9.2 | 23.65,4.45 23.8,4.6 23.8,5.05 JP1.GND 23.65,4.45 | 17.01,4.15 D7.1 | 4.25,1.32 1.32,1.32 1.28,1.28 J3.1 | 23.86,4.23 23.65,4.45 | v28.45,37.37 | v28.45,37.37 29.91,37.37 29.97,37.44 30.19,37.22 v30.32,37.36 30.35,37.33 30.5,37.18 | U8.4 25.48,38.76 25.48,41.25 U2.8 25.48,41.33 26.24,41.33 26.47,41.55 26.47,42.24 26.16,42.55 25.48,42.55 U2.6 | S4.2 36.14,23.11 36.14,21.36 36.13,21.34 36.07,21.28 C63.2 35.99,21.21 34.54,21.21 C60.2 34.47,21.21 32.94,21.21 C61.2 32.87,21.28 32.11,22.05 32.11,23.11 S4.1 32.11,23.19 32.11,23.26 32.11,23.65 32.64,24.18 32.64,25.82 32.64,26.39 32.11,26.92 R34.1 32.11,27 32.21,27.1 32.72,27.61 35.4,27.61 | U$5.P$10 38.09,30.14 38.05,30.12 37.14,29.21 37.14,28.3 D13.C 37.06,28.22 | 38.21,32.25 38.12,32.33 U$5.P$12 | 25.85,29.85 24.33,29.85 24.15,30.03 C64.2 | 33.79,46.97 34.09,47.27 34.93,47.27 35.23,46.96 35.23,46.58 U1.2 35.31,46.51 35.31,46.13 36.37,45.06 36.37,43.83 v36.68,43.53 36.83,43.53 38.05,42.31 C10.2 | 33.79,46.97 33.55,46.74 32.87,46.74 C13.2 32.79,46.66 30.73,46.66 27.69,43.61 | Y3.2 10.39,45.59 10.39,46.66 9.78,47.27 9.78,48.64 11.45,48.64 12.14,47.95 Y3.4 12.22,47.88 13.28,47.88 13.67,47.5 C32.1 13.74,47.42 15.19,47.42 C59.2 15.27,47.42 15.88,46.81 15.88,46.58
  Top 0.076: U2.9 31.04,41.33 31.04,41.86 U2.10 | U2.11 31.04,42.55 31.04,41.94 U2.10 | 15.88,46.58 15.88,45.21 14.66,43.99 14.05,43.99 C31.1 | 15.88,46.58 18.85,46.58 19.61,45.82 C45.1 19.69,45.74 20.37,45.06 21.28,45.06 21.36,45.14 25.4,45.14 U2.2 25.48,45.14 26.16,45.14 27.69,43.61 | 27.69,43.61 28.37,42.93 28.37,42.85 29.36,41.86 30.96,41.86 U2.10 | J4.20 43.46,49.55 43.46,52.15 X1.4 | X1.5 38.43,52.22 38.43,57.17 X1.2 | S3.1 5.82,54.51 1.78,54.51 S3.2 1.7,54.43 1.7,54.05 1.09,53.44 1.09,52.38 1.85,51.61 3.33,51.61 5.55,49.38 | L4.2 4.6,40.49 4.6,40.64 6.12,42.16 C62.2 | C62.2 6.2,42.16 8.33,42.16 13.28,37.21 U12.EP | C62.2 6.21,42.28 6.21,48.72 8.94,48.72 10.7,50.48 18.89,50.48 19.17,50.2 | v18.71,49.74 19.17,50.2 | C47.2 20.07,50.47 20.03,50.47 19.53,50.47 19.22,50.16 19.17,50.2 | v5.51,32.41 4.97,31.86 C67.1 | D3.1 24.87,32.64 24.71,32.49 23.04,32.49 D6.1 22.96,32.41 22.96,30.76 v23.16,30.57 | 22.12,20.74 22.12,20.83 C53.2 | v33.69,47.07 33.79,46.97 | C66.1 4.67,37.1 v5.51,37.1
  Top 0.127: v15.33,50.88 19.68,50.88 20.05,50.51
  Top 0.152: E2.GND2 18.46,51.3 | E2.GND 20.66,51.04 C47.2 | v8.22,49.18 5.76,49.18 5.55,49.38 | C55.2 37.55,13.4 U11.4 | 37.59,14.43 36.13,14.43 R27.1 36.05,14.35 24.83,14.35 24.38,13.89 | C56.2 41.41,12.59 42.25,11.75 42.25,10.01 42.66,9.59 | 37.59,14.29 37.59,13.97 38.57,13 39.52,12.04 U11.2 39.23,11.52 39.09,11.52 39,11.43 39,10.76 39.13,10.63 39.13,10.61 | 20.07,13.55 20.16,13.55 | 39.05,10.69 39.6,10.13 39.6,9.59 | C65.2 40.28,8.91 41.98,8.91 42.65,9.58 | 42.67,9.6 43.33,8.94 43.38,8.94 | J4.4 44.53,7.75 44.53,5.89 43.84,5.21 | 37.74,5.82 38.35,5.21 43.84,5.21 | 43.84,5.21 44.53,4.52 44.53,3.36 43.41,2.24 J4.1 42.35,2.31 39.04,2.31 | C50.2 29.04,2.35 27.42,3.97 24.12,3.97 24.06,4.04 | 24.06,4.04 23.86,4.23 23.81,4.28 JP1.GND | 24.06,4.04 23.44,3.42 19.57,3.42 19.1,3.89 17.28,3.89 17.01,4.15 | D7.1 16.89,4.29 16.89,5.2 16.65,5.44 14.87,5.44 13.46,4.03 U$4.2 12.35,4.45 D5.1 9.88,4.45 8.81,3.38 | C9.2 6.28,3.35 4.25,1.32 4.21,1.28 1.28,1.28 | 36.13,21.34 36.02,21.23 C61.2 32.11,22.06 32.11,23.26 | C63.2 36.03,23.04 S4.2 | 32.65,25.32 32.65,24.2 32.05,23.59 S4.1 | 32.65,25.32 32.64,25.34 32.64,25.82 | 32.65,25.32 32.65,26.66 32.21,27.1 | 37.14,28.3 36.32,28.3 35.99,27.96 35.76,27.96 35.4,27.61 32.75,27.61 R34.1 31.46,26.95 28.67,29.75 27.41,31 26.95,31 U$2.2 26.83,30.33 26.83,30.22 26.45,29.85 25.85,29.85 | D13.C 37.09,29.14 38.09,30.14 | U9.6 22.64,18.75 22.64,18.76 22.64,20.22 22.12,20.74 | C53.2 22.08,25.8 v22.14,25.86
  Top 0.2: U8.4 26.29,38.62 27.54,37.37 v28.45,37.37 | U$5.P$1 29.84,38.49 29.89,38.49 30,38.38 30,37.47 30.13,37.33 30.35,37.33 | v30.32,37.36 32.32,35.37 32.42,35.37 32.43,35.35 33.27,35.35 35.96,32.67 37.79,32.67 38.21,32.25 | U$5.P$12 38.5,31.98 v39.07,31.98 39.07,30.39 38.82,30.14 38.09,30.14 | C55.2 37.45,14.35 24.83,14.35 | v26.04,30.37 26.79,30.37 26.83,30.33
  Top 0.254: 18.46,51.3 v18.36,51.2 | C47.2 20.09,50.47 20.03,50.47 | R27.1 24.89,14.41 24.38,13.89 | 23.85,9.17 23.27,9.75 U9.16 23.27,13.1 22.78,13.59 22.38,13.59 22.34,13.55 20.16,13.55 | C51.2 23.86,9.17 22.47,9.17 | 20.07,13.55 19.36,12.84 C49.2
  Bottom 0.076: X2.C5 9.4,26.09 9.4,21.51 2.54,14.66 2.54,10.16 J3.4 1.32,8.86 1.32,7.8 2.39,6.73 2.39,2.39 J3.1 | 30.37,36.37 30.35,36.37 U4.96 30.32,36.42 v30.32,37.36 | ANT1.3 34.47,31.11 ANT1.4 34.39,31.11 34.39,31.05 | C4.2 38.81,45.9 37.67,44.75 C12.2 37.59,44.75 37.52,44.68 37.52,43.61 C11.1 37.44,43.54 37.44,43.53 | 38.58,46.2 38.81,45.97 C4.2 | 38.58,46.2 R10.1 | 37.44,43.53 37.44,40.72 34.47,37.74 34.47,36.75 ANT1.6 | 38.58,46.2 39.42,47.04 39.42,47.88 38.89,48.41 38.73,48.41 PS1.2 | 38.58,46.2 C4.2 | v36.68,43.53 37.44,43.53 | 28.91,53.06 28.75,53.21 T1.2 28.91,53.06 | 32.49,52.6 D1.1 | 23.11,52.83 T2.2 | C7.1 33.19,56.78 33.22,56.8 | 29.43,53.58 28.91,53.06 | 8.33,46.96 9.09,46.96 | 9.09,46.96 9.78,46.96 U4.65 11.3,46.89 | 8.33,46.96 8.18,47.12 U4.64 8.33,46.96 | 11.3,46.89 11.61,46.89 U4.71 11.3,46.89 | 8.33,46.96 8.18,46.81 8.18,46.05 U4.63 8.1,45.97 7.8,45.97 7.26,45.44 7.26,44.45 7.87,43.84 8.1,43.84 U4.61 8.18,43.76 8.18,42.77 U4.60 8.18,42.7 | 9.09,46.96 9.09,48.56 U4.1 | 11.3,46.89 11.3,48.56 U4.3 | 17.86,48.26 17.09,47.5 17.09,46.96 U4.79 17.02,46.89 13.51,46.89 U4.77 | 17.86,48.26 17.86,48.56 U4.9 | v18.71,49.74 17.93,48.96 17.93,48.64 U4.9 | 8.18,40.56 9.78,40.56 U4.68 9.86,40.56 11.61,40.56 U4.74 | U4.57 8.18,39.5 8.18,40.49 U4.58 8.18,40.56 | U4.77 13.44,46.96 13.44,48.56 U4.5 | 8.18,42.7 9.78,42.7 U4.67 | U4.67 11.61,42.7 U4.73 | 8.18,42.7 8.18,41.71 U4.59 8.18,41.63 8.18,40.56 | U4.67 9.86,44.75 U4.66 9.86,44.83 11.61,44.83 U4.72 11.68,44.83 13.44,46.58 13.44,46.89 U4.77 | C3.2 34.39,43.38 34.39,44.53 C5.2 34.39,44.6 34.39,45.59 34.47,45.67 C2.2 34.47,45.74 34.47,46.89 C1.2
  Bottom 0.076: 34.32,47.19 34.32,47.04 34.39,46.96 C1.2 | 34.32,47.19 34.32,48.11 C14.1 | U4.88 28.6,40.64 28.6,42.62 U4.87 28.6,42.7 | 28.6,42.7 30.28,42.7 U4.93 30.35,42.62 30.35,40.64 U4.94 30.35,40.56 30.35,38.51 U4.95 | U4.81 23.19,46.96 23.19,48.41 23.34,48.56 U4.14 | U4.20 30.05,48.64 31.04,48.64 U4.21 | 28.6,44.83 30.28,44.83 U4.92 | 28.6,46.89 30.28,46.89 U4.91 30.35,46.96 30.51,47.12 31.12,47.12 | 31.12,47.12 32.03,47.12 U4.22 32.11,47.19 33.69,47.19 | 28.6,46.89 28.6,44.83 | 28.6,44.83 U4.86 28.6,44.75 28.6,42.7 | 28.6,46.89 U4.85 28.52,46.89 26.77,46.89 U4.83 26.58,47.06 23.32,47.06 U4.81 | 31.12,47.12 31.12,48.56 U4.21 | 33.69,47.19 34.32,47.19 | 34.32,47.19 C1.2 | 8.03,37.13 8.1,37.21 U4.55 8.03,37.13 | U4.75 11.61,38.51 9.86,38.51 U4.69 9.86,38.43 9.86,36.45 U4.70 | U4.70 9.86,36.37 11.61,36.37 U4.76 | U4.54 8.1,36.07 8.1,35.36 5.51,32.77 v5.51,32.41 6.5,31.42 12.83,31.42 13.09,31.68 13.09,33.75 | 8.41,36.37 9.78,36.37 U4.70 | 8.41,36.37 8.18,36.14 U4.54 | 8.03,37.08 8.03,36.75 8.41,36.37 | 8.03,37.08 8.03,37.13 | 8.41,36.37 U4.54 | U4.78 13.44,36.37 13.44,35.99 12.45,35 12.45,34.7 U4.50 12.45,34.62 12.45,34.39 13.09,33.75 | 17.55,36.37 18.69,36.37 20.07,35 20.07,34.7 U4.43 20.07,34.62 20.07,34.39 17.55,31.88 17.32,31.88 C46.2 16.57,31.86 14.73,33.7 13.14,33.7 13.09,33.75 | 17.09,36.37 16.98,36.37 16.98,37.17 17.38,37.57 21.99,37.57 23.11,36.45 U4.82 23.19,36.37 | 17.55,36.37 17.09,36.37 | 17.09,36.37 U4.80 17.55,36.37 | U$1.2 20.68,31.27 21.82,31.27 21.94,31.34 R3.2 23.16,31.34 v23.16,30.57 23.16,31.16 D2.1 23.27,31.27 23.27,31.5 23.95,32.18 23.95,36.37 | U4.95 30.28,38.51 28.6,38.51 U4.89 28.45,38.39
  Bottom 0.076: U4.30 32.03,38.35 30.43,38.35 30.35,38.43 U4.95 | 26.16,36.37 26.7,36.37 U4.84 26.77,36.37 | 26.16,36.37 23.95,36.37 | 23.95,36.37 23.19,36.37 | 23.19,36.37 | 26.16,36.37 26.16,33.93 26.01,33.78 26.01,31.5 U$3.2 | v22.14,25.86 25.7,29.42 D4.1 | 17.86,48.26 18.01,48.26 19.38,46.89 23.11,46.89 U4.81 | 17.86,48.26 U4.9 | X1.5 38.35,52.15 38.21,52.01 36.83,50.62 36.83,50.55 36.68,50.39 35.69,50.39 35.44,50.65 33.12,50.65 31.12,48.64 U4.21 | 33.69,47.19 v33.69,47.07 | v5.51,37.1 8.01,37.1 8.03,37.08
  Bottom 0.127: v15.33,50.88 13.5,49.05 U4.5
  Bottom 0.152: U4.9 17.9,49.28 17.49,49.69 17.49,50.69 17.96,51.16 18.36,51.16 18.41,51.21 v18.37,51.21 v18.36,51.2 | U4.64 8.15,49.11 v8.22,49.18 | D1.1 32.49,52.21 32.64,52.06 34.57,52.06 34.86,52.35 L1.2 | D4.1 25.71,30.09 26.01,30.39 26.01,31.42 U$3.2 | U4.32 30.6,36.14 30.37,36.37 | C15.2 41.95,32.69 41.95,32.23
  Bottom 0.2: 26.77,36.37 26.79,36.39 U4.90 28.45,36.49 28.45,38.39 | U4.84 23.21,36.39 23.19,36.37 | ANT1.3 41.04,31.12 41.05,31.11 41.95,32.01 41.95,32.23 | ANT1.3 39.07,31.37 v39.07,31.98 | ANT1.3 34.39,31.11 | 34.39,31.05 34.39,30.25 28.94,24.8 28.94,16.45 LS1.2 28.84,14.36 v28.83,14.35 | 33.22,56.8 33.66,57.25 X1.2 X1.3 X1.4 43.3,52.01 38.21,52.01 | C7.1 32.63,56.09 31.94,56.09 29.43,53.58 29.06,53.21 28.75,53.21 | D1.1 31.41,52.63 31.16,52.38 30.02,52.38 29.14,53.26 T1.2 25.93,53.26 25.52,53.67 23.95,53.67 23.11,52.83 | 26.01,30.39 v26.04,30.37
  pour Bottom: -1.9,59.55 -1.9,-2.27 48.09,-2.27 48.09,59.56 -1.9,59.56 -1.91,59.55
  pour Top: -1.96,59.62 48.44,59.62 48.44,-2.15 -1.96,-2.15
GPIO1
  Bottom 0.076: R9.2 25.25,50.77 25.25,48.95 25.55,48.64 U4.16
GPIO2  (via drill 0.2)
  Top 0.076: v29.57,46.05 29.9,46.05 31.77,47.92 v31.87,47.92 | v33.71,49.78 33.75,49.74 36.59,49.74 v36.72,49.87
  Bottom 0.076: 37.29,48.95 38.2,48.95 38.66,49.4 PS1.3 | 37.29,48.95 37.21,48.95 R10.2 37.29,48.95 | v29.57,46.05 32.03,46.05 U4.23 | v33.71,49.78 32.65,49.78 31.87,49 v31.87,47.92 | v36.72,49.87 36.72,49.52 37.29,48.95
GPIO3  (via drill 0.2)
  Top 0.076: v33.21,44.91 31.95,44.91 31.57,44.53 31.04,44.53 U2.14
  Bottom 0.076: v33.21,44.91 32.11,44.91 U4.24
GPIO4  (via drill 0.2)
  Top 0.076: v29.84,43.84 30.96,43.84 U2.13
  Bottom 0.076: v29.84,43.84 32.03,43.84 U4.25
GPIO5  (via drill 0.2)
  Top 0.076: v21.39,33.29 21.39,32.86 D6.2 21.89,32.41 21.01,32.41 20.76,32.16 20.76,31.44 21.43,30.77 v21.43,30.75 | v20.83,29.66 20.05,28.88 v19.85,28.88
  Bottom 0.076: R3.1 21.39,32.56 v21.39,33.29 21.39,34.28 21.21,34.47 21.21,34.62 U4.42 | v19.85,28.88 17.35,26.38 X2.SW2 | v20.83,29.66 20.83,29.78 20.85,29.8 20.85,30.17 v21.43,30.75
GPIO6
  Bottom 0.076: R7.2 29.52,50.7 29.52,49.48 28.91,48.87 28.91,48.64 U4.19
GPIO23  (via drill 0.2)
  Top 0.076: v18.4,44.69 18.29,44.58 18.29,41.91 16.33,39.95 16.33,39.34 U12.36 | v20.6,46.45 20.57,46.48 v20.57,47.37
  Bottom 0.076: v20.6,46.45 18.83,44.69 v18.4,44.69 | v20.57,47.37 19.96,47.37 19.08,48.26 19.08,48.56 U4.10
LNA_IN1  (via drill 0.2)
  Top 0.076: U12.2 10.31,38.96 7.72,38.96 6.27,40.41 L4.1 6.44,40.73 v6.96,41.25 | v6.96,46.28 9.63,48.95 12.75,48.95 12.83,48.87 23.34,48.87 C48.1
  Bottom 0.076: v6.96,41.25 v6.96,46.28
N$1
  Bottom 0.076: L2.1 34.39,55.27 33.78,55.27 33.33,55.27 33.25,55.35 C7.2
  Bottom 0.61: L2.1 33.27,55.27 C7.2 | D1.2 R1.2 33.78,55.27
N$2
  Bottom 0.076: C6.2 36.14,52.22 36.14,53.67 L1.1 36.14,53.75 35.92,53.97 35.92,55.12 C8.2
N$3  (via drill 0.2)
  Top 0.076: R2.2 15.81,3.15 16.94,3.15 D7.2 15.98,2.11 v15.98,1.85
  Bottom 0.076: v15.98,1.85 v15.98,1.86 X2.SW1
N$4  (via drill 0.2)
  Top 0.076: v8.79,31.8 8.79,31.76 7.53,30.5 v5.37,30.5 | v4.28,33.41 4.28,33.3 v3.56,32.59
  Bottom 0.076: v8.79,31.8 9.07,31.95 10.13,31.95 10.81,32.63 R6.1 | v5.37,30.5 4.92,30.5 3.56,31.86 v3.56,32.59 | v4.28,33.41 4.28,35.07 4.81,35.61 4.81,36.07 4.75,36.13 4.75,39.13 4.66,39.22 4.66,39.99 4.75,40.08 4.75,46.88 14.06,56.18 25.86,56.18 LED1.2
N$5
  Bottom 0.076: 40.9,54.72 X1.1
  Bottom 0.61: 40.9,54.72 38.34,54.72 36.6,56.46 C8.1 34.8,56.46 L2.2
N$6
  Bottom 0.076: LED1.1 27.53,56.18 28.91,56.18 29.59,55.5 T1.3
N$7
  Bottom 0.076: R7.1 30.89,50.77 31.65,50.77 32.41,51.54 36.75,51.54 36.98,51.77 36.98,55.27 36.45,55.8 34.73,55.8 34.62,55.7 33.81,55.7 33.62,55.88 32.72,55.88 30.66,53.82 30.66,53.29 T1.1
N$8
  Bottom 0.076: R8.1 7.8,32.64 8.56,32.64 9.17,33.25 11.3,33.25 12.29,32.26 12.29,32.11 LED2.2
N$9
  Bottom 0.076: LED2.1 13.89,32.03 13.67,32.03 12.9,31.27 5.95,31.27 5.14,32.08 5.14,38.78 5.46,39.1 5.46,40.28 5.03,40.71 5.03,46.66 13.34,54.97 23.95,54.97 T2.3
N$10  (via drill 0.2)
  Top 0.076: v24.54,50.25 26.56,50.25 27.45,51.14 35.6,51.14 35.76,51.3 35.76,51.99 35.46,52.3 v25.86,52.3
  Bottom 0.076: v24.54,50.25 v24.54,50.26 23.95,50.85 R9.1 | v25.86,52.3 25.2,52.95 T2.1
N$15  (via drill 0.2)
  Top 0.076: v19.51,33.21 19.51,34.33 19.07,34.78 U8.8 | SJ1.2 13.86,31.78 v15.13,31.78
  Bottom 0.076: v19.51,33.21 19,32.7 19,31.88 C46.1 18.92,31.8 18.31,31.19 16.64,31.19 16.17,31.66 15.25,31.66 v15.13,31.78
N$17
  Top 0.076: R25.2 20.83,9.25 20.83,12.06 20.75,12.14 U9.12
N$24  (via drill 0.2)
  Top 0.076: R26.2 25.4,10.4 v25.33,10.47 | v20.45,11.2 20.45,11.52 20.14,11.84 20.14,12.14 U9.11
  Bottom 0.076: v25.33,10.47 25.31,10.45 21.21,10.45 v20.45,11.2
N$39
  Top 0.076: Q4.5 24.03,26.01 26.09,23.95 26.92,23.95 R31.2
N$40
  Top 0.076: Q4.2 23.95,27.84 23.95,26.7 23.72,26.47 23.72,24.56 23.88,24.41 R32.2
N$41
  Top 0.076: U12.45 12.37,40.11 12.37,43.92 C31.2 12.29,43.99 11.53,44.75 11.53,45.82 10.47,46.89 10.47,47.88 Y3.1
N$42
  Top 0.076: U12.44 12.67,40.15 12.67,43.08 12.98,43.38 12.98,44.75 12.83,44.91 | 12.83,44.91 12.22,45.52 Y3.3 | 12.83,44.91 13.67,45.74 C32.2
N$43
  Top 0.076: D13.A 37.14,26.47 38.66,26.47 R33.2
N$44  (via drill 0.2 pad 0.1)
  Top 0.127: R33.1 40.33,24.81 v40.49,24.65 | SJ5.1 40.33,23.3 v40.79,22.84
  Bottom 0.127: v40.49,24.65 40.79,24.35 v40.79,22.84
N$45
  Top 0.076: D14.C 35.46,26.92 33.86,26.92 R34.2
N$46
  Top 0.076: U12.47 11.61,40.03 11.61,39.73 11.84,39.5 15.65,39.5 16.64,40.49 16.64,45.74 R24.1 16.71,45.74 18.16,45.74 C68.2
N$49
  Bottom 0.076: TP11.TP 27.23,50.77 27.23,49.1 26.77,48.64 U4.17
N$50
  Bottom 0.076: TP12.TP 34.7,39.42 32.11,39.42 U4.29
N$51
  Bottom 0.076: TP13.TP 34.7,40.94 32.49,40.94 32.11,40.56 U4.28
N$54  (via drill 0.2)
  Top 0.076: v15.51,30.89 16.86,30.89 17.4,30.35 R40.1 | v21.56,22.17 15.57,28.16 v15.57,28.37 | v25.23,13.27 25.78,12.71 25.78,12.22 U9.20
  Bottom 0.076: v15.57,28.37 15.51,28.43 15.51,28.75 15.94,29.17 15.94,30.43 15.51,30.85 v15.51,30.89 | v21.56,22.17 21.56,16.93 v25.23,13.27
N$55  (via drill 0.2)
  Top 0.076: v15.45,30.3 15.45,30.29 16.26,30.29 R41.2 | v15.15,28.91 15.56,28.91 18.12,26.35 22.39,26.35 22.96,25.77 22.96,18.77 23.88,17.86 23.88,17.55 U9.4
  Bottom 0.076: v15.45,30.3 15.61,30.14 15.61,29.19 15.33,28.91 v15.15,28.91
PWR_ON  (via drill 0.2)
  Top 0.076: TP20.TP 40.87,7.42 40.87,5.89 F2.2 40.79,5.89 39.12,5.89 C54.1 39.04,5.89 38.43,6.5 36.75,6.5 36.68,6.43 | 36.68,6.43 36.68,5.36 37.97,4.06 38.96,4.06 C50.1 | v22.72,11.03 22.66,11.1 22.66,12.14 U9.15 | 36.68,6.43 v35.38,7.72 | v24.99,47.44 25.3,47.44 28.36,50.5 36.79,50.5 v39.8,47.5
  Bottom 0.076: 26.7,11.3 31.8,11.3 v35.38,7.72 | v22.72,11.03 26.4,11.03 26.47,11.03 26.7,11.26 26.7,11.3 | v24.99,47.44 24.56,47.87 24.56,48.56 U4.15 | v39.8,47.5 39.66,47.36 39.66,34.09 38.81,33.25 32.72,33.25 27.76,28.3 26.77,28.3 26.7,28.22 26.7,11.3
RESET_N  (via drill 0.2)
  Top 0.076: U9.13 21.44,12.22 21.97,12.22 U9.14 22.05,12.22 22.05,12.61 v22.57,13.14 | 26.16,17.68 26.16,16.94 25.82,16.6 | 26.16,17.68 26.16,18.16 23.8,20.52 23.8,20.83 C53.1 | 25.82,16.6 25.13,16.6 24.56,17.17 24.56,17.47 U9.3 | v28.51,17.33 29.27,16.56 29.59,16.56 TP21.TP | 26.16,17.68 v27.18,17.68 | 25.82,16.6 v26.22,16.6 | v29.47,47.52 30.08,47.52 31.04,48.49 33.09,48.49 33.97,47.62 v36.42,47.62
  Bottom 0.076: v28.51,17.33 27.53,17.33 v27.18,17.68 | v22.57,13.14 v22.57,13.13 22.95,12.75 25.4,12.75 26.22,13.57 v26.22,16.6 26.47,16.85 26.47,33.55 26.66,33.74 27.11,33.74 27.23,33.86 27.23,35.46 27.38,35.61 29.06,35.61 29.29,35.84 29.29,37.22 29.89,37.82 34.32,37.82 36.22,39.73 36.22,44.14 37.29,45.21 37.82,45.21 38.05,45.44 38.05,46.51 37.63,46.92 36.84,46.92 36.42,47.35 v36.42,47.62 | v29.47,47.52 29.4,47.59 28.58,47.59 27.84,48.34 27.84,48.56 U4.18
RTS
  Top 0.076: Q4.4 23.34,26.01 23.34,25.09 23.19,24.94 23.19,23.42 23.88,22.73 R32.1 23.88,22.66 23.11,21.89 23.11,20.29 25.17,18.24 25.17,17.55 U9.2
RXD  (via drill 0.1, 0.2)
  Top 0.076: R41.1 16.3,32.8 v16.26,32.84 | U12.27 16.35,35.77 v17.88,35.77 | v22.18,47.44 22.18,47.28 v21.4,46.5 | v18.69,40.49 v18.69,43.84
  Bottom 0.076: 22.28,48.64 U4.13 22.18,48.46 22.18,48.21 v22.18,47.44 | v17.88,35.77 17.71,35.77 17.55,35.61 17.48,35.61 17.32,35.46 17.32,33.78 16.33,33.78 16.26,33.85 | v16.26,32.84 16.26,33.85 | v21.4,46.5 21.32,46.5 18.69,43.88 v18.69,43.84 | v18.69,40.49 17.34,40.49 16.18,39.32 16.18,35.53 16.26,35.46 16.26,33.86 16.26,33.85
  Bottom 0.152: 22.18,48.21 22.19,48.22 TP19.TP 22.19,48.73 22.28,48.64
S$1  (via drill 0.2)
  Top 0.076: R2.1 15.77,4.29 v16.49,5.01
  Bottom 0.152: TP1.TP 27.87,3.62 17.88,3.62 v16.49,5.01
SCL  (via drill 0.2)
  Top 0.076: v33.4,42.77 34.24,43.61 U1.5 | v35.35,41.91 35.93,41.33 38.81,41.33 40.43,42.94 40.43,43.42 40.08,43.76 37.9,43.76 TP2.TP
  Bottom 0.076: U4.27 32.11,41.71 32.33,41.71 v33.4,42.77 33.55,42.62 34.09,42.62 34.8,41.91 v35.35,41.91
SCL2  (via drill 0.2)
  Top 0.076: U1.1 35.76,46.51 37.65,44.62 v40.1,44.62 40.58,44.14 40.58,40.35 38.12,37.9 U$5.P$17
  Bottom 0.076: v40.1,44.62 40.19,44.71 40.19,49.01 38.96,50.24 35.62,50.24 35.37,50.49 34.75,50.49 34.39,50.14 34.39,49.33 R5.1
SDA  (via drill 0.2)
  Top 0.076: U1.4 34.19,46.57 v33.76,46.15 | v35.78,48.36 35.43,48.72 34.47,48.72 TP3.TP
  Bottom 0.076: v33.76,46.15 33.76,44.2 33.13,43.57 | 33.13,43.57 32.33,42.77 32.11,42.77 U4.26 | v35.78,48.36 35.78,47.97 35,47.19 35,43 34.77,42.77 33.93,42.77 33.13,43.57
SDA2
  Top 0.076: U1.8 35.69,43.76 35.69,43.31 34.62,42.24 34.62,41.1 R4.1 34.62,41.02 34.62,40.26 38.05,36.83 U$5.P$16
SDIO_CMD  (via drill 0.2)
  Top 0.076: v29.47,42.29 30.33,43.16 30.96,43.16 U2.12
  Bottom 0.076: v29.47,42.29 29.47,40.21 29.13,39.88 17.03,39.88 16.33,39.18 16.33,35.84 16.79,35.38 16.79,34.7 U4.46
SHIELD
  Top 0.076: JP1.SHIELD1 18.85,2.39 22.5,2.39 JP1.SHIELD3 22.58,2.39 26.16,2.39 JP1.SHIELD2
SIM_CLK  (via drill 0.2)
  Top 0.076: v25.64,33.37 26.01,32.99 26.01,32.71 D3.2 | v25.36,30.31 25.36,31.08 U$2.1
  Bottom 0.076: U4.38 25.63,34.62 25.64,34.61 v25.64,33.37 25.36,33.09 v25.36,30.31 25.17,30.13 25.17,29.29 25.02,29.13 24.87,29.13 20.07,24.34 20.07,9.16 14.58,3.67 14.58,1.47 X2.C3
SIM_IO
  Bottom 0.076: U4.39 24.56,34.62 24.64,34.54 24.64,31.5 U$3.1 24.64,31.42 24.64,29.59 D4.2 24.56,29.51 24.31,29.27 18.6,29.27 15.49,26.16 14.58,26.16 X2.C7
SIM_RST
  Bottom 0.076: U4.40 23.34,34.62 23.27,34.54 23.27,32.41 D2.2 23.19,32.33 22.73,31.87 21.84,31.87 21.23,32.49 20.68,32.49 U$1.1 20.6,32.49 19.84,31.72 19.84,31.01 16.08,27.26 13.85,27.26 13.28,26.7 13.28,7.34 12.06,6.12 12.06,1.47 X2.C2
TIMEPULSE
  Top 0.076: U$5.P$4 29.29,35.76 28.85,35.76 26.48,38.12 24.64,38.12 24.49,38.28 24.49,41.48 24.56,41.55 26.24,41.55 26.31,41.63 26.31,42.16 26.24,42.24 24.56,42.24 24.49,42.32 24.49,42.77 24.87,43.16 25.4,43.16 U2.5
TRACE_ANT1
  Top 0.152: 21.84,51.6 C47.1 C48.2
  Top 0.254: E2.ANT 21.84,51.6
TXD  (via drill 0.2)
  Top 0.076: v17.78,33.48 17.02,34.24 | 17.02,34.24 16.33,34.92 U12.25 | v16.85,32.81 16.85,32.26 R40.2 | v21.13,45.47 20.98,45.62 20.98,47.11 v21.15,47.28 | v21.12,37.03 21.12,42.88 v21.14,42.9 | v20.9,36.07 20.9,35.8 20.35,35.24 18.02,35.24 17.02,34.24
  Bottom 0.076: TP18.TP 20.68,50.7 20.68,49.1 21.13,48.64 U4.12 21.15,48.57 v21.15,47.28 | v17.78,33.48 17.11,32.81 v16.85,32.81 | v21.13,45.47 21.14,45.46 v21.14,42.9 | v21.12,37.03 21.12,36.29 v20.9,36.07
TXD1
  Top 0.076: U$5.P$2 29.29,37.97 27.87,37.97 26.77,39.07 26.77,43.38 26.96,43.57 26.96,43.84 26.35,44.45 25.48,44.45 U2.3
U0RXD  (via drill 0.2)
  Top 0.076: v14.35,42.43 14.35,40.11 U12.40 | v20.66,41.12 19.73,42.05 v19.73,42.43 | v27.69,41.25 29.52,41.25 30.89,39.88 32.79,39.88 37.59,35.08 42.7,35.08 43.31,35.69 43.84,35.69 44.53,36.37 44.53,40.79 43.46,41.86 J4.17
  Bottom 0.076: v19.73,42.43 v14.36,42.43 v14.35,42.43 | v27.69,41.25 27.56,41.12 v20.66,41.12
U0TXD  (via drill 0.2)
  Top 0.076: v13.96,40.9 13.96,40.1 U12.41 | v21.54,42.16 21.54,41 24.71,37.82 26.55,37.82 28.68,35.69 28.68,35.23 28.75,35.15 32.33,35.15 33.08,34.4 v33.08,32.38 | v42.39,43.38 43.38,44.37 J4.18
  Bottom 0.076: v13.96,40.9 13.99,40.93 16.32,40.93 17.25,41.86 21.23,41.86 v21.54,42.16 | v33.08,32.38 33.48,32.78 38.82,32.78 40.11,34.08 40.11,41.1 v42.39,43.38
V_BATT
  Top 0.076: 1.38,6.35 J3.3
  Top 0.152: J4.3 41.25,8.48 19.08,8.48 18.71,8.11 18.71,7.53 17.53,6.35 1.38,6.35
V_INT  (via drill 0.2, 0.35)
  Top 0.076: v12.69,49.73 17.81,49.73 18.21,49.33 22.66,49.33 23.19,49.86 27.39,49.86 28.22,50.69 38.09,50.69 v41.98,46.8 | v31.73,31.22 33.4,29.55 v33.4,28.4
  Bottom 0.076: v12.69,49.73 12.45,49.49 12.45,48.64 U4.4 | v41.98,46.8 41.98,43.96 39.89,41.87 39.89,34.11 38.84,33.06 33.06,33.06 31.73,31.73 v31.73,31.22
V_USB
  Top 0.152: R27.2 37.3,16.11 D9.A
VCC
  Bottom 0.076: C3.1 35.69,43.38 35.69,44.53 C5.1 35.69,44.6 35.69,45.59 35.76,45.67 C2.1 | 35.76,45.97 35.76,46.89 C1.1 | 35.76,45.97 35.76,45.74 C2.1 | 35.76,45.97 37.52,45.97 C4.1 | 35.76,45.97 C2.1
VIN
  Top 0.076: D9.C 39.65,16.03 39.65,14.73 39.42,14.5 C55.1 39.42,14.43 39.42,14.42 39.42,13.36 39.73,13.06 U11.3 39.8,13.06 39.95,12.91 40.49,12.37 40.49,11.68 39.95,11.15 39.8,11.15 U11.1
  Top 0.152: D9.C 39.67,14.67 39.42,14.42 | C55.1 39.36,13.5 39.95,12.91
VSIM  (via drill 0.2)
  Top 0.076: U$4.1 12.14,3.38 10.92,3.38 D5.2 10.85,3.38 9.63,3.38 C9.1 9.55,3.3 9.45,3.21 v9.45,2.57 | v22.29,33.32 22.29,33 22.43,32.87 22.43,32.11 22.1,31.78 v21.36,31.78
  Bottom 0.076: v9.45,2.57 X2.C1 9.47,1.4 10.31,0.56 12.67,0.56 13.44,1.32 13.44,26.62 13.89,27.08 16.14,27.08 19.99,30.93 19.99,31.57 20.2,31.78 v21.36,31.78 | U4.41 v22.29,33.32
VUSB-RAW
  Top 0.076: J4.2 43.38,3.76 42.77,3.15 40.87,3.15 F2.1 40.79,3.15 30.96,3.15 25.93,8.18 19.99,8.18 19.38,7.57 C49.1 | 19.38,6.96 19.38,7.49 C49.1 | 19.59,6.75 21.21,5.13 JP1.VBUS | 19.59,6.75 19.38,6.96 | 19.59,6.75 18.29,6.75 17.37,5.83 3.31,5.83 1.32,3.84 J3.2 | 19.38,6.96 C49.1

## Text on the board
tPlace: 36 | GND | 37 | 21 | 38 | TX | 39 | RX | 32 | 22 | 33 | 19 | 34 | 23 | 35 | 18 | 25 | 5 | 26 | 15 | 27 | 2 | 14 | 0 | 12 | 13 | 17 | !RST! | 16 | 3V3 | 3V3 | GND | GND | VBAT
bPlace: 36 | GND | 37 | 21 | 38 | TXO | 39 | RXI | 32 | 22 | 33 | 19 | 34 | 23 | 35 | 18 | 25 | 5 | 26 | 15 | 27 | 2 | 14 | 0 | 12 | 13 | 17 | !RST! | 16 | 3V3 | 3V3 | GND | GND | VBAT | VBAT | VUSB | VUSB | GND | GND